# EAGLE design SimpleC64Cart (EAGLE 7.7.0)
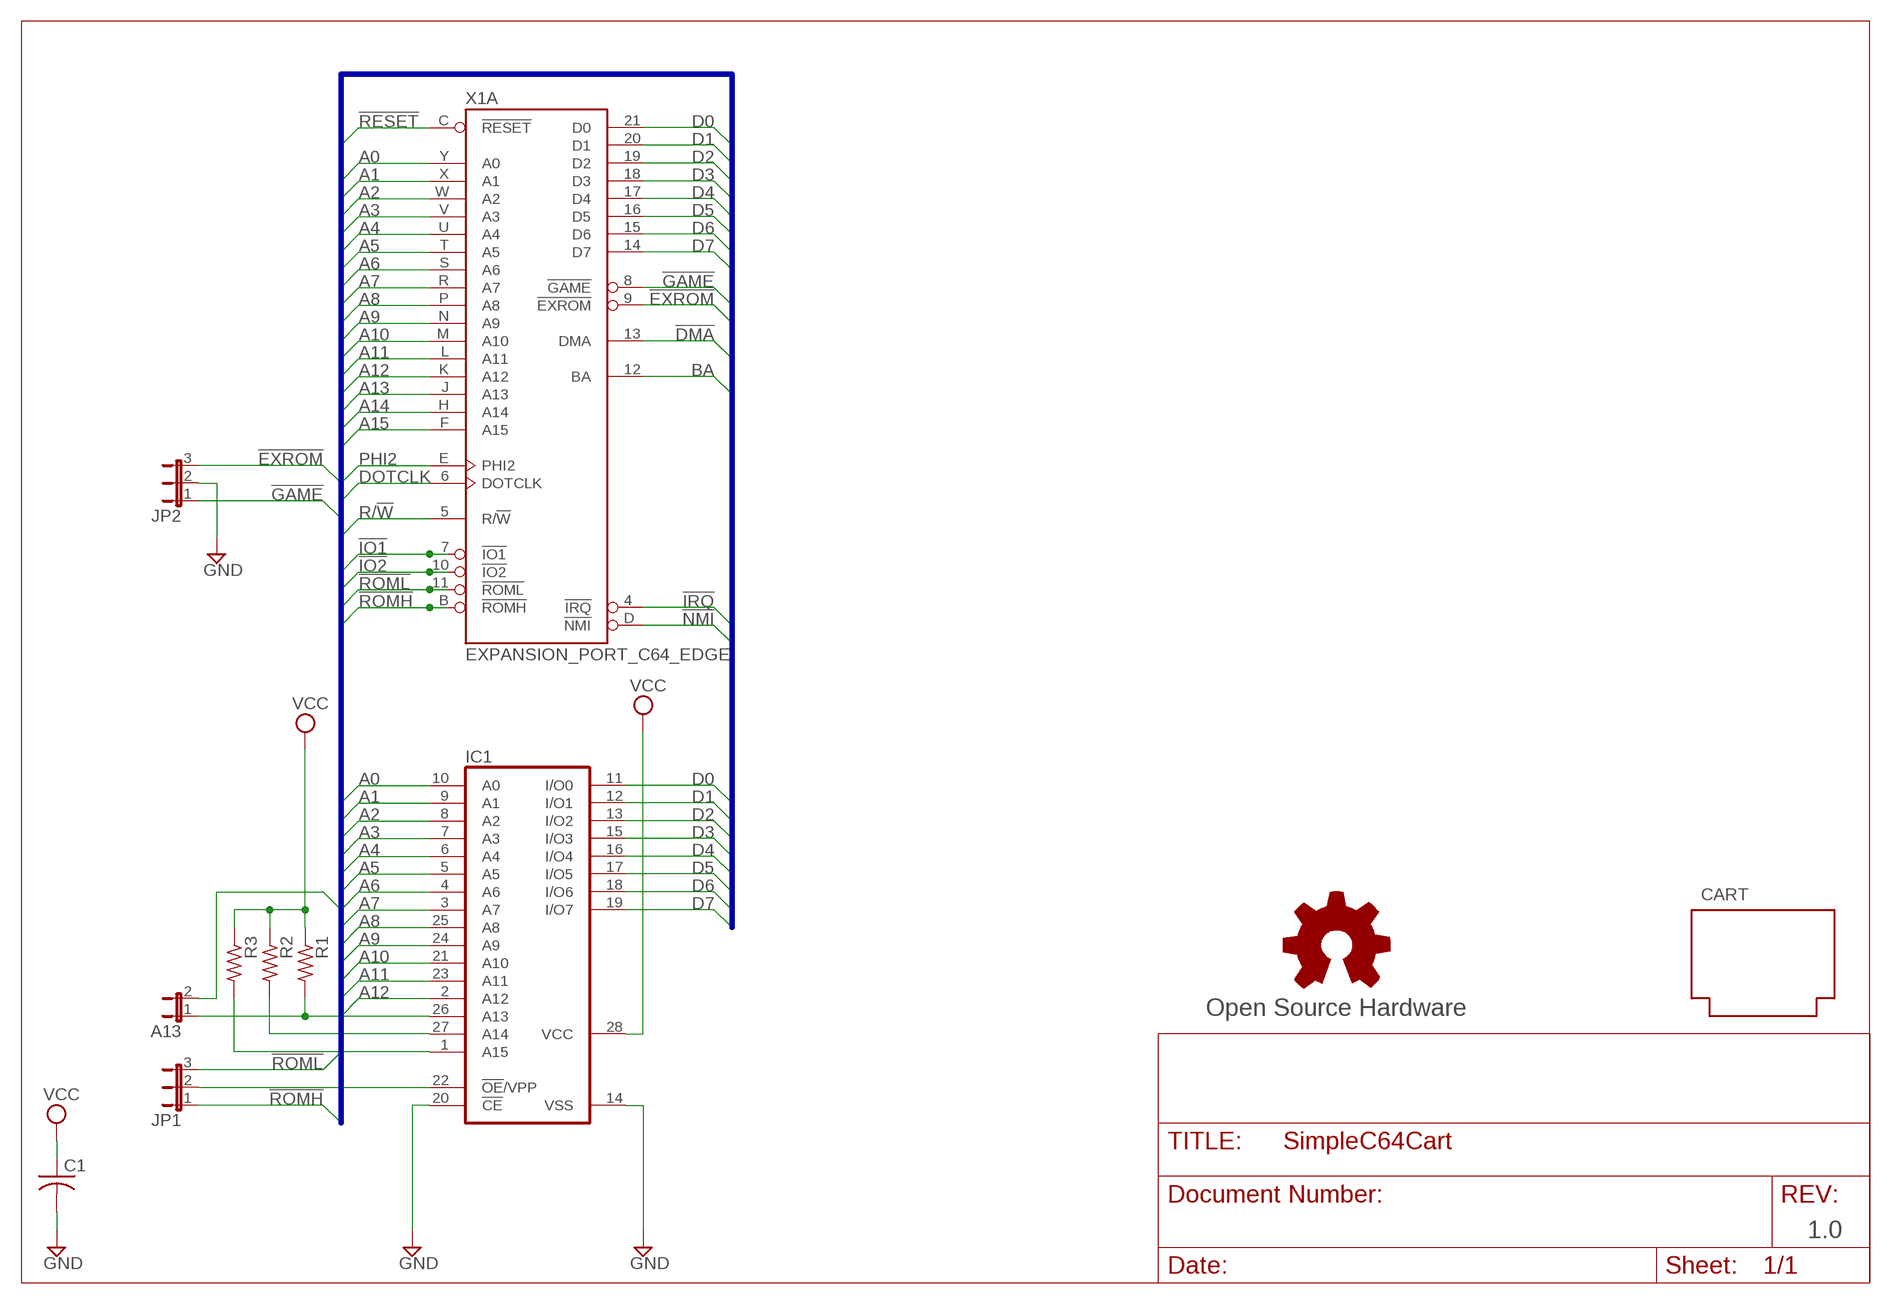
[diagram p0: schematic, sheet 1]

## Parts
A13  JP1E  [JP1]
C1  C-US025-025X050  [C025-025X050]
CART  CARTRIDGE_C64  [CARTRIDGE_C64]
GOLD_ORB_SM1  Open Source Hardware  OSHWLOGOLOGO8MM  [OSHW_8MM]
IC1  27512G  [DIL28-6]
JP1  JP2E  [JP2]
JP2  JP2E  [JP2]
R1  R-US_0204/7  [0204/7]
R2  R-US_0204/7  [0204/7]
R3  R-US_0204/7  [0204/7]
X1  EXPANSION_PORT_C64_EDGE  [MA100-22-2]

## Nets
!DMA: X1.13(A:DMA)
!EXROM: JP2.3 X1.9(A:!EXROM)
!GAME: JP2.1 X1.8(A:!GAME)
!IO1: X1.7(A:!IO1)
!IO2: X1.10(A:!IO2)
!IRQ: X1.4(A:!IRQ)
!NMI: X1.D(A:!NMI)
!RESET: X1.C(A:!RESET)
!ROMH: JP1.1 X1.B(A:!ROMH)
!ROML: JP1.3 X1.11(A:!ROML)
A0: IC1.10(A0) X1.Y(A:A0)
A1: IC1.9(A1) X1.X(A:A1)
A2: IC1.8(A2) X1.W(A:A2)
A3: IC1.7(A3) X1.V(A:A3)
A4: IC1.6(A4) X1.U(A:A4)
A5: IC1.5(A5) X1.T(A:A5)
A6: IC1.4(A6) X1.S(A:A6)
A7: IC1.3(A7) X1.R(A:A7)
A8: IC1.25(A8) X1.P(A:A8)
A9: IC1.24(A9) X1.N(A:A9)
A10: IC1.21(A10) X1.M(A:A10)
A11: IC1.23(A11) X1.L(A:A11)
A12: IC1.2(A12) X1.K(A:A12)
A13: A13.2 X1.J(A:A13)
A14: X1.H(A:A14)
A15: X1.F(A:A15)
ADDR13: A13.1 IC1.26(A13) R1.2
ADDR14: IC1.27(A14) R2.2
ADDR15: IC1.1(A15) R3.2
BA: X1.12(A:BA)
D0: IC1.11(I/O0) X1.21(A:D0)
D1: IC1.12(I/O1) X1.20(A:D1)
D2: IC1.13(I/O2) X1.19(A:D2)
D3: IC1.15(I/O3) X1.18(A:D3)
D4: IC1.16(I/O4) X1.17(A:D4)
D5: IC1.17(I/O5) X1.16(A:D5)
D6: IC1.18(I/O6) X1.15(A:D6)
D7: IC1.19(I/O7) X1.14(A:D7)
DOTCLK: X1.6(A:DOTCLK)
GND: C1.2 IC1.14(VSS) IC1.20(!CE) JP2.2
N$1: IC1.22(!OE!/VPP) JP1.2
PHI2: X1.E(A:PHI2)
R/!W: X1.5(A:R/!W)
VCC: C1.1 IC1.28(VCC) R1.1 R2.1 R3.1

## Buses
A[0..15],D[0..7],!IRQ,!NMI,BA,!DMA,DOTCLK,!IO1,!GAME,!EXROM,!IO2,!ROML,!ROMH,!RESET,PHI2,R/!W

## Notes on the sheet
- 1.0

## Power pins joined to a net without a drawn wire
GND: X1.1(P:GND) X1.22(P:GND) X1.A(P:GND) X1.Z(P:GND)
VCC: X1.2(P:VCC) X1.3(P:VCC)

## Library data of the parts
A13 = jumper:JP1E: JUMPER
C1 = rcl:C-US: CAPACITOR, American symbol
CART = commodore:CARTRIDGE_C64
GOLD_ORB_SM1 = oshw:OSHWLOGO: The OSHW logo for PCB layout
IC1 = memory-hitachi:27512G: MEMORY; OC_FARNELL: unknown; OC_NEWARK: unknown
JP1 JP2 = jumper:JP2E: JUMPER
R1-R3 = resistor:R-US_: RESISTOR, American symbol
X1 = commodore:EXPANSION_PORT_C64_EDGE

## Board
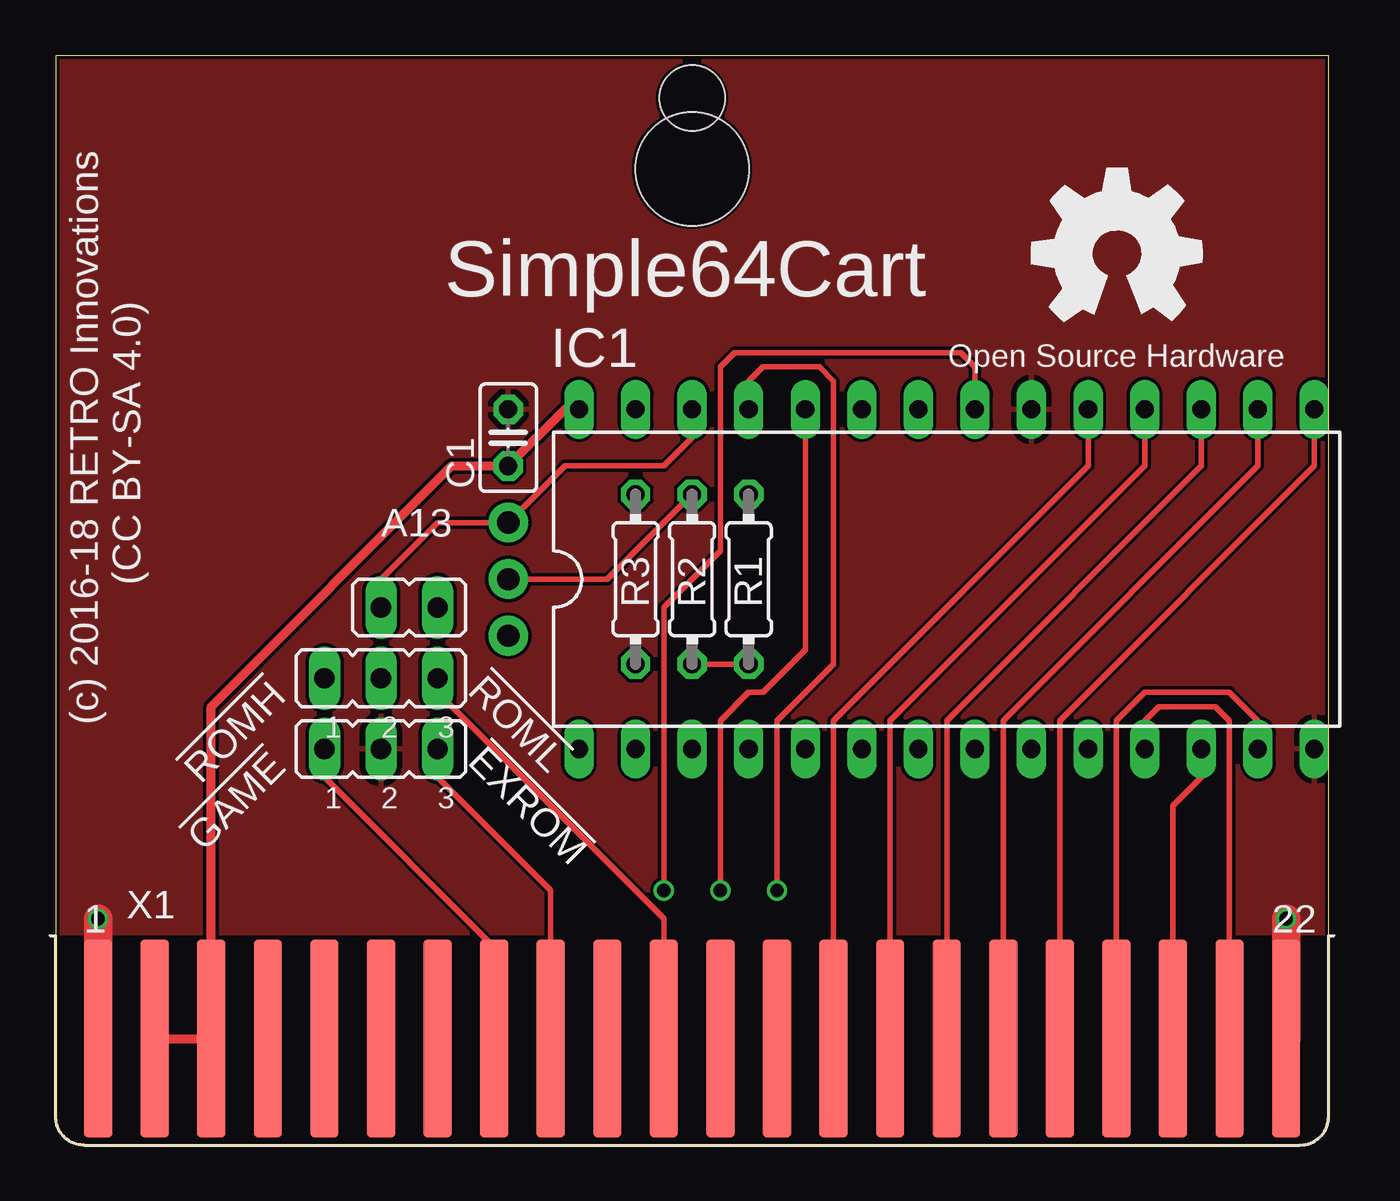
[diagram p1: board, top side]
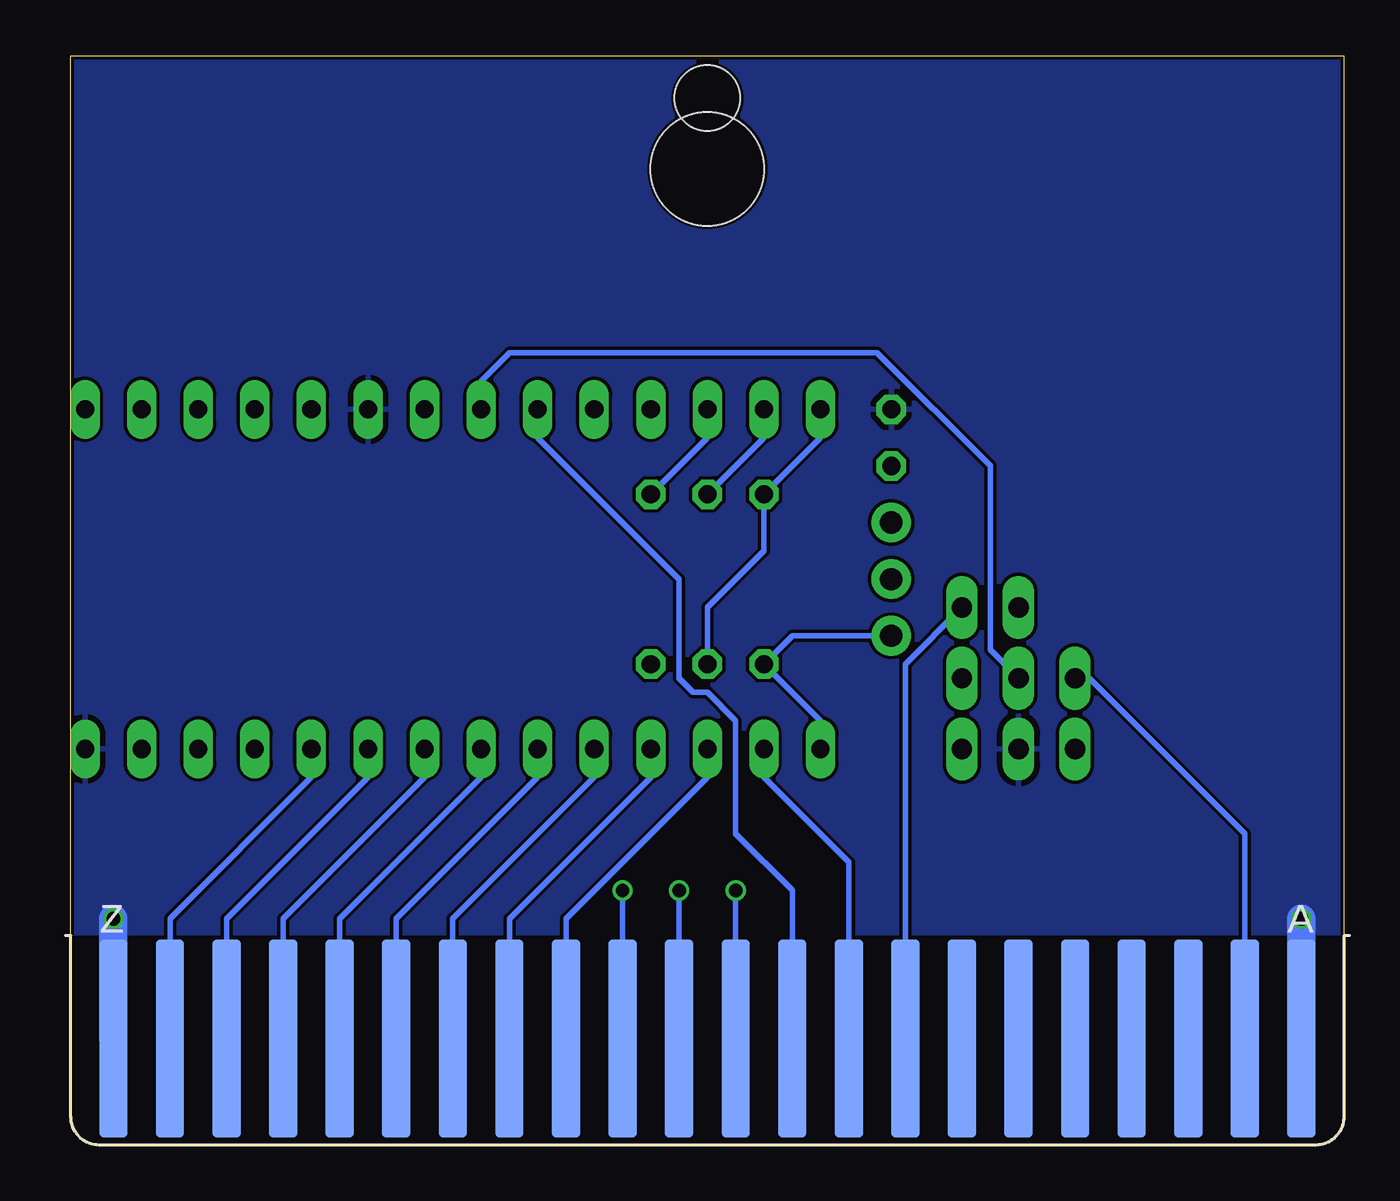
[diagram p2: board, bottom side, seen from below]

Size 57.15 x 48.9 mm. Coordinates in mm from the lower left corner, seen from the top.
Outline: 0,48.9 0,1.27 arc90 1.27,0 55.88,0 arc90 57.15,1.27 57.15,48.9 0,48.9
Copper layers (1*16): Top 0.035mm / dielectric 1.5mm / Bottom 0.035mm
Design rules "hackvana *": minimum track width 6mil, minimum drill 0.3mm, track to track 6mil, track to pad 6mil, pad to pad 6mil, via to via 6mil, smd to smd 0mil, copper to edge 6mil, drill to drill 6mil, minimum pad ring 10mil, minimum via ring 6mil, stop-mask expansion 2mil, vias tented up to drill 100mil, thermal gap 10mil

### Footprints (pad centres in the part's own frame; a part is rotated, then mirrored left to right if it is on the bottom)
JP1 = drill 0.914 long: 1 0,-1.27; 2 0,1.27
C025-025X050 = drill 0.813 octagon: 1 -1.27,0; 2 1.27,0
CARTRIDGE_C64 = hole 5.08: 0,43.815 | hole 2.921: 0,46.99
DIL28-6 = drill 0.813 long: 1 -16.51,-7.62; 2 -13.97,-7.62; 3 -11.43,-7.62; 4 -8.89,-7.62; 5 -6.35,-7.62; 6 -3.81,-7.62; 7 -1.27,-7.62; 8 1.27,-7.62; 9 3.81,-7.62; 10 6.35,-7.62; 11 8.89,-7.62; 12 11.43,-7.62; 13 13.97,-7.62; 14 16.51,-7.62; 15 16.51,7.62; 16 13.97,7.62; 17 11.43,7.62; 18 8.89,7.62; 19 6.35,7.62; 20 3.81,7.62; 21 1.27,7.62; 22 -1.27,7.62; 23 -3.81,7.62; 24 -6.35,7.62; 25 -8.89,7.62; 26 -11.43,7.62; 27 -13.97,7.62; 28 -16.51,7.62
JP2 = drill 0.914 long: 1 -2.54,0; 2 0,0; 3 2.54,0
0204/7 = drill 0.813 octagon: 1 -3.81,0; 2 3.81,0
MA100-22-2 = smd 1.27 x 8.89: 1 -26.67,-0.305; 2 -24.13,-0.305; 3 -21.59,-0.305; 4 -19.05,-0.305; 5 -16.51,-0.305; 6 -13.97,-0.305; 7 -11.43,-0.305; 8 -8.89,-0.305; 9 -6.35,-0.305; 10 -3.81,-0.305; 11 -1.27,-0.305; 12 1.27,-0.305; 13 3.81,-0.305; 14 6.35,-0.305; 15 8.89,-0.305; 16 11.43,-0.305; 17 13.97,-0.305; 18 16.51,-0.305; 19 19.05,-0.305; 20 21.59,-0.305; 21 24.13,-0.305; 22 26.67,-0.305 | smd 1.27 x 8.89 bottom: A -26.67,-0.305; B -24.13,-0.305; C -21.59,-0.305; D -19.05,-0.305; E -16.51,-0.305; F -13.97,-0.305; H -11.43,-0.305; J -8.89,-0.305; K -6.35,-0.305; L -3.81,-0.305; M -1.27,-0.305; N 1.27,-0.305; P 3.81,-0.305; R 6.35,-0.305; S 8.89,-0.305; T 11.43,-0.305; U 13.97,-0.305; V 16.51,-0.305; W 19.05,-0.305; X 21.59,-0.305; Y 24.13,-0.305; Z 26.67,-0.305

### Placement (x,y rotation side)
A13  15.88,24.13 270 top
C1  20.32,31.75 90 top
CART  28.57,0 0 top
GOLD_ORB_SM1  47.62,40.01 0 top
IC1  40,25.4 0 top
JP1  14.6,20.95 0 top
JP2  14.6,17.78 0 top
R1  31.11,25.4 90 top
R2  28.57,25.4 90 top
R3  26.04,25.4 270 top
X1  28.57,5.08 0 top

### Tracks (layer width: path | path; a pad name or v marks a point on that pad's centre or on a via)
!EXROM
  Top 0.254: JP2.3 17.14,16.51 22.23,11.43 X1.9
!GAME
  Top 0.254: JP2.1 12.06,16.51 19.68,8.89 X1.8
!ROMH
  Bottom 0.254: JP1.1 11.43,20.95 4.45,13.97 X1.B
!ROML
  Top 0.254: JP1.3 17.14,20.32 27.3,10.16 X1.11
A0
  Bottom 0.254: IC1.10 46.36,16.51 52.7,10.16 X1.Y
A1
  Bottom 0.254: IC1.9 43.81,16.51 50.16,10.16 X1.X
A2
  Bottom 0.254: IC1.8 41.27,16.51 47.62,10.16 X1.W
A3
  Bottom 0.254: IC1.7 38.73,16.51 45.09,10.16 X1.V
A4
  Bottom 0.254: IC1.6 36.2,16.51 42.55,10.16 X1.U
A5
  Bottom 0.254: IC1.5 33.66,16.51 40,10.16 X1.T
A6
  Bottom 0.254: IC1.4 31.11,16.51 37.47,10.16 X1.S
A7
  Bottom 0.254: IC1.3 28.57,16.51 34.92,10.16 X1.R
A8  (via drill 0.6)
  Top 0.254: v32.38,11.43 32.38,19.05 34.92,21.59 34.92,34.29 34.29,34.92 31.75,34.92 31.11,34.29 IC1.25
  Bottom 0.254: X1.P v32.38,11.43
A9  (via drill 0.6)
  Top 0.254: v29.84,11.43 29.84,19.05 31.11,20.32 31.75,20.32 33.66,22.23 IC1.24
  Bottom 0.254: X1.N v29.84,11.43
A10  (via drill 0.6)
  Top 0.254: v27.3,11.43 27.3,24.13 29.84,26.67 29.84,34.92 30.48,35.56 40.64,35.56 41.27,34.92 IC1.21
  Bottom 0.254: X1.M v27.3,11.43
A11
  Bottom 0.254: IC1.23 36.2,31.75 29.84,25.4 29.84,20.95 29.21,20.32 28.57,20.32 27.3,19.05 27.3,13.97 24.77,11.43 X1.L
A12
  Bottom 0.254: IC1.2 26.04,16.51 22.23,12.7 X1.K
A13
  Bottom 0.254: A13.2 19.68,21.59 X1.J
ADDR13  (via drill 1 pad 1.78)
  Top 0.254: IC1.26 28.57,31.75 27.3,30.48 22.86,30.48 v20.32,27.94 17.14,27.94 14.6,25.4 A13.1
  Bottom 0.254: IC1.26 28.57,31.75 R1.2
ADDR14  (via drill 1 pad 1.78)
  Top 0.254: v20.32,25.4 24.77,25.4 R2.2
  Bottom 0.254: IC1.27 26.04,31.75 R2.2
ADDR15  (via drill 1 pad 1.78)
  Bottom 0.254: IC1.1 23.49,19.05 R3.2 24.77,22.86 v20.32,22.86
D0
  Top 0.254: IC1.11 48.89,19.05 49.53,19.68 52.07,19.68 52.7,19.05 X1.21
D1
  Top 0.254: IC1.12 51.44,16.51 50.16,15.24 X1.20
D2
  Top 0.254: IC1.13 53.97,19.05 52.7,20.32 48.89,20.32 47.62,19.05 X1.19
D3
  Top 0.254: IC1.15 56.52,30.48 45.09,19.05 X1.18
D4
  Top 0.254: IC1.16 53.97,30.48 42.55,19.05 X1.17
D5
  Top 0.254: IC1.17 51.44,30.48 40,19.05 X1.16
D6
  Top 0.254: IC1.18 48.89,30.48 37.47,19.05 X1.15
D7
  Top 0.254: IC1.19 46.36,30.48 34.92,19.05 X1.14
GND  (via drill 0.61)
  Top 1.27: v1.9,10.16 X1.A | v55.25,10.16 X1.Z
  Bottom 1.27: v1.9,10.16 X1.A | v55.25,10.16 X1.Z
  pour Top: 0,48.9 57.15,48.9 57.15,9.53 0,9.53
  pour Bottom: 0,48.9 0,9.53 57.15,9.53 57.15,48.9
N$1
  Bottom 0.254: JP1.2 15.88,22.23 15.88,30.48 20.95,35.56 37.47,35.56 38.73,34.29 IC1.22
VCC
  Top 0.254: R1.1 R2.1
  Top 0.406: X1.2 X1.3 6.98,19.68 17.78,30.48 C1.1 22.86,33.02 IC1.28
  Bottom 0.254: IC1.28 23.49,31.75 R3.1 26.04,26.67 28.57,24.13 R2.1

### Text on the board
tPlace: Simple64Cart | (c) 2016-18 RETRO Innovations | (CC BY-SA 4.0) | !ROMH | !ROML | !GAME | !EXROM